# EAGLE design ZigFlea_v6 (EAGLE 5.08)
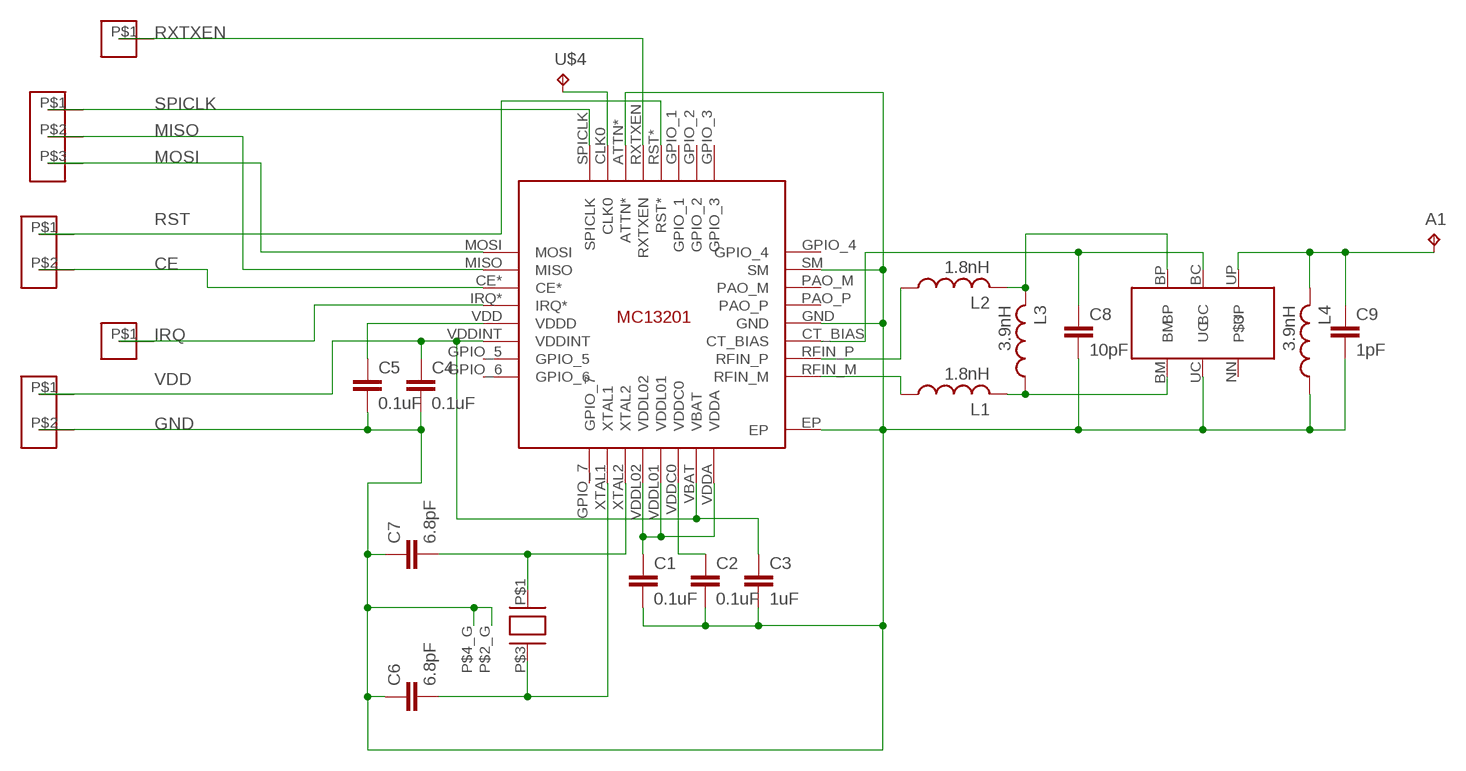
[diagram p0: schematic, sheet 1]

## Parts
A1  TPTP06SQ  [TP06SQ]
C1  0.1uF  C-EUC0603  [C0603]
C2  0.1uF  C-EUC0603  [C0603]
C3  1uF  C-EUC0603  [C0603]
C4  0.1uF  C-EUC0603  [C0603]
C5  0.1uF  C-EUC0603  [C0603]
C6  6.8pF  C-EUC0603  [C0603]
C7  6.8pF  C-EUC0603  [C0603]
C8  10pF  C-EUC0603  [C0603]
C9  1pF  C-EUC0603  [C0603]
L1  1.8nH  SPOLE0603  [SPOLE0603]
L2  1.8nH  SPOLE0603  [SPOLE0603]
L3  3.9nH  SPOLE0603  [SPOLE0603]
L4  3.9nH  SPOLE0603  [SPOLE0603]
RD8  PINHEAD1_1MM  [PINHEAD_1MM]
RE4  PINHEAD1_1MM  [PINHEAD_1MM]
U$1  MC13201  [MC13201]
U$2  16MHZ  [16MHZ]
U$3  BALUN  [BALUN]
U$4  TPTP06SQ  [TP06SQ]
U$5  PINHEAD3_1MM  [PINHEAD3_1MM]
U$6  PINHEAD2_1MM  [PINHEAD2_1MM]
U$7  PINHEAD2_1MM  [PINHEAD2_1MM]

## Nets
A1: A1.TP C9.1 L4.P$2 U$3.UP
CE: U$1.CE* U$6.P$2
GND: C1.2 C2.2 C3.2 C4.2 C5.2 C6.1 C7.1 C8.2 C9.2 L4.P$1 U$1.ATTN* U$1.EP U$1.GND U$1.SM U$2.P$2_G(P$3_G) U$2.P$4_G U$3.UC U$7.P$2
IRQ: RD8.P$1 U$1.IRQ*
MISO: U$1.MISO U$5.P$2
MOSI: U$1.MOSI U$5.P$3
N$1: C1.1 U$1.VDDA U$1.VDDL01 U$1.VDDL02
N$2: C2.1 U$1.VDDC0
N$3: U$1.CLK0 U$4.TP
N$4: C7.2 U$1.XTAL2 U$2.P$1
N$6: L1.P$1 U$1.RFIN_M
N$7: L2.P$1 U$1.RFIN_P
N$8: C5.1 U$1.VDD(VDDD)
N$9: C6.2 U$1.XTAL1 U$2.P$3
N$10: C8.1 U$1.CT_BIAS U$3.BC
N$11: L1.P$2 L3.P$1 U$3.BM
N$12: L2.P$2 L3.P$2 U$3.BP
RST: U$1.RST* U$6.P$1
RXTXEN: RE4.P$1 U$1.RXTXEN
SPICLK: U$1.SPICLK U$5.P$1
VDD: C3.1 C4.1 U$1.VBAT U$1.VDDINT U$7.P$1
Unconnected: U$1.GPIO_1 U$1.GPIO_2 U$1.GPIO_3 U$1.GPIO_4 U$1.GPIO_5 U$1.GPIO_6 U$1.GPIO_7 U$1.PAO_M U$1.PAO_P U$3.NN

## Library data of the parts
A1 U$4 = testpad:TP: Test pad
C1-C9 = resistor:C-EU: CAPACITOR, European symbol
L1-L4 = resistor:SPOLE0603
RD8 RE4 = Pinhead_my:PINHEAD1_1MM
U$1 = mc13201:MC13201
U$2 = mc13201:16MHZ
U$3 = freescale_16qfn:BALUN
U$5 = Pinhead_my:PINHEAD3_1MM
U$6 U$7 = Pinhead_my:PINHEAD2_1MM

## Board
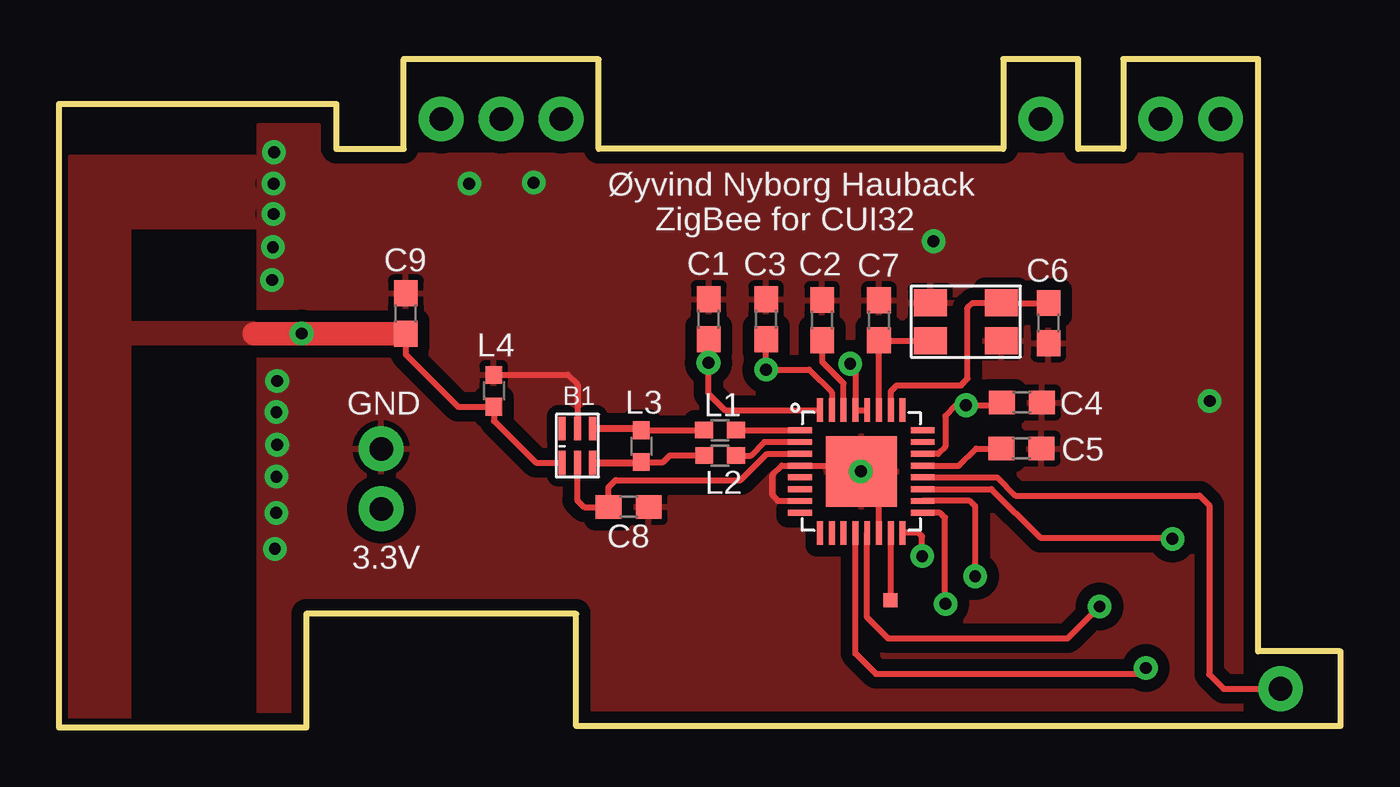
[diagram p1: board, top side]
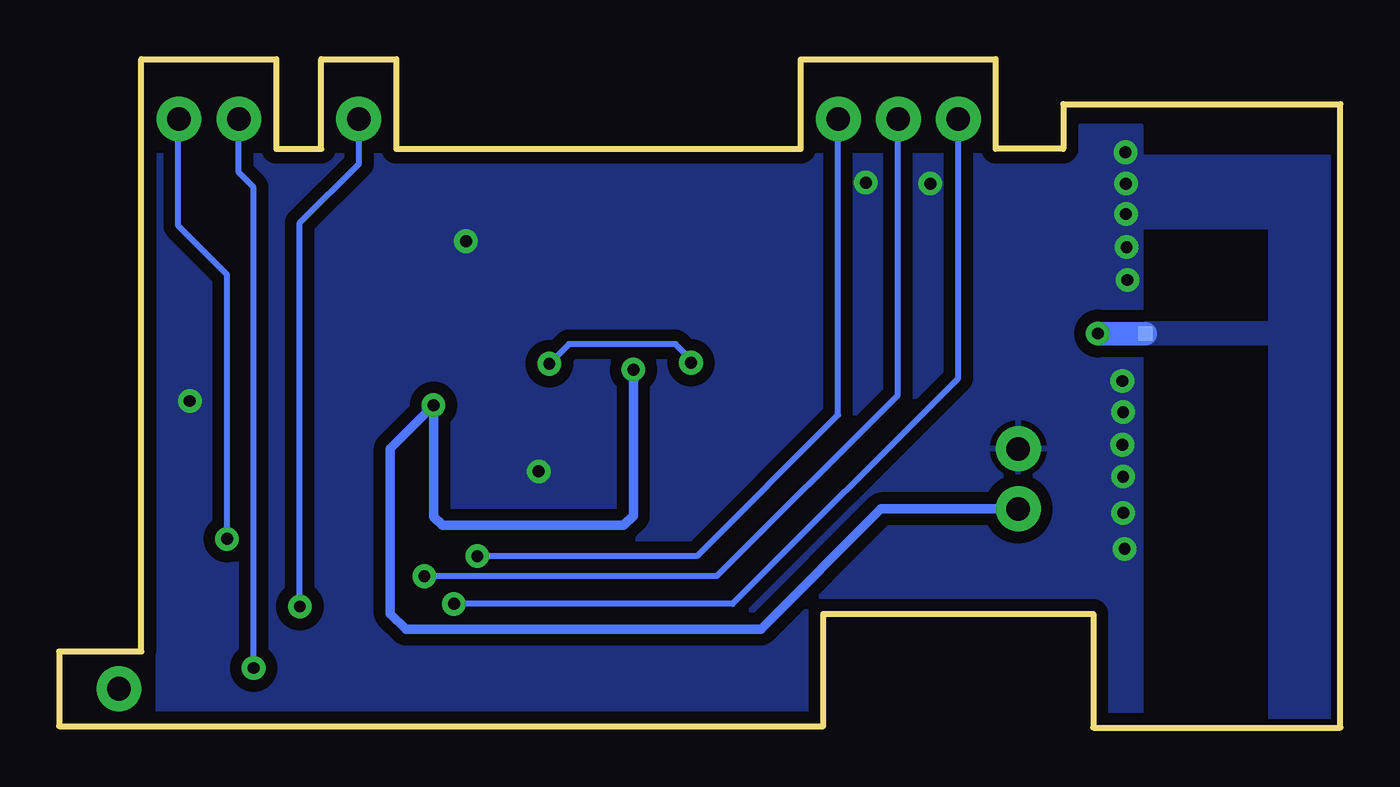
[diagram p2: board, bottom side, seen from below]

Size 54.29 x 28.32 mm. Coordinates in mm from the lower left corner, seen from the top.
Outline: 54.29,3.24 50.8,3.24 50.8,28.32 45.09,28.32 45.09,24.51 43.18,24.51 43.18,28.32 40,28.32 40,24.51 22.86,24.51 22.86,28.31 14.6,28.32 14.6,24.51 11.75,24.51 11.75,26.42 0,26.42 0,0 10.48,0 10.48,4.83 21.91,4.83 21.91,0.06 54.29,0.06 54.29,3.24
Copper layers (1*16): Top 0.035mm / dielectric 1.5mm / Bottom 0.035mm
Design rules "SeedDRC": minimum track width 6mil, minimum drill 10mil, track to track 6mil, track to pad 6mil, pad to pad 6mil, via to via 6mil, smd to smd 6mil, copper to edge 10mil, drill to drill 10mil, minimum pad ring 10mil, minimum via ring 6mil, stop-mask expansion 2mil, vias tented up to drill 100mil, thermal gap 10mil

### Footprints (pad centres in the part's own frame; a part is rotated, then mirrored left to right if it is on the bottom)
TP06SQ = smd 0.6 x 0.6: TP 0,0
C0603 = smd 1.1 x 1: 1 -0.85,0; 2 0.85,0
SPOLE0603 = smd 0.75 x 0.7: P$1 -0.675,0; P$2 0.675,0
PINHEAD_1MM = drill 1 pad 1.9 round: P$1 0,0
MC13201 = smd 0.25 x 1: ATTN* -0.75,2.6; CLK0 -1.25,2.6; GPIO_1 0.75,2.6; GPIO_2 1.25,2.6; GPIO_3 1.75,2.6; GPIO_7 -1.75,-2.6; RST* 0.25,2.6; RXTXEN -0.25,2.6; SPICLK -1.75,2.6; VBAT 1.25,-2.6; VDDA 1.75,-2.6; VDDC0 0.75,-2.6; VDDL01 0.25,-2.6; VDDL02 -0.25,-2.6; XTAL1 -1.25,-2.6; XTAL2 -0.75,-2.6 | smd 1 x 0.25: CE* -2.6,0.75; CT_BIAS 2.6,-0.75; GND 2.6,-0.25; GPIO_4 2.6,1.75; GPIO_5 -2.6,-1.25; GPIO_6 -2.6,-1.75; IRQ* -2.6,0.25; MISO -2.6,1.25; MOSI -2.6,1.75; PAO_M 2.6,0.75; PAO_P 2.6,0.25; RFIN_M 2.6,-1.75; RFIN_P 2.6,-1.25; SM 2.6,1.25; VDD -2.6,-0.25; VDDINT -2.6,-0.75 | smd 3 x 3: EP 0,0
16MHZ = smd 1.4 x 1.15: P$1 1.5,0.8; P$2_G 1.5,-0.8; P$3 -1.5,-0.8; P$4_G -1.5,0.8
BALUN = smd 0.3 x 1: BC 0.65,1.45; BM 0,0; BP 0,1.45; NN 1.3,0; UC 0.65,0; UP 1.3,1.45
PINHEAD3_1MM = drill 1 pad 1.9 round: P$1 0,2.54; P$2 0,0; P$3 0,-2.54
PINHEAD2_1MM = drill 1 pad 1.9 round: P$1 0,1.27; P$2 0,-1.27

### Placement (x,y rotation side)
A1  8.27,16.69 0 bottom
C1  27.53,17.31 90 top
C2  32.33,17.27 90 top
C3  29.96,17.3 90 top
C4  40.8,13.77 0 top
C5  40.77,11.83 0 top
C6  41.92,17.14 90 top
C7  34.74,17.26 270 top
C8  24.14,9.35 0 top
C9  14.69,17.54 90 top
L1  28,12.61 180 top
L2  28.01,11.53 180 top
L3  24.67,11.92 270 top
L4  18.42,14.27 270 top
RD8  51.75,1.65 0 top
RE4  41.59,25.78 0 top
U$1  33.99,10.85 180 top
U$2  38.42,17.2 180 top
U$3  22.61,12.67 180 top
U$4  35.23,5.4 180 top
U$5  18.73,25.78 270 top
U$6  47.94,25.78 90 top
U$7  13.65,10.54 180 top

### Tracks (layer width: path | path; a pad name or v marks a point on that pad's centre or on a via)
A1  (via drill 0.5 pad 1)
  Top 0.25: U$3.UP 20.2,11.22 18.42,13 18.42,13.58 L4.P$2 16.91,13.59 14.69,15.82 C9.1
  Top 1: A1.TP C9.1 | A1.TP | v10.28,16.7 A1.TP
  Bottom 1: A1.TP v10.27,16.69 v10.28,16.7
  pour Top (isolate 0.254, no thermals): 8.52,21.19 8.52,24.19 0.47,24.19 0.47,0.39 2.97,0.39 2.97,16.29 8.27,16.29 8.27,17.14 2.97,17.14 2.97,21.19
  pour Bottom (no thermals): 8.27,17.14 2.97,17.14 2.97,21.19 8.52,21.19 8.52,24.19 0.47,24.19 0.47,0.39 2.97,0.39 2.97,16.29 8.27,16.29
CE  (via drill 0.5 pad 1)
  Top 0.25: U$1.CE* 39.51,10.1 41.57,8.05 47.13,8.05 v47.17,8
  Bottom 0.25: v47.17,8 47.17,19.19 49.24,21.26 49.24,25.76 U$6.P$2
GND  (via drill 0.5 pad 1)
  Top 0.25: U$1.ATTN* 34.74,10.1 U$1.EP 33.74,11.1 | C1.2 | U$3.UC 21.96,14.54 21.55,14.95 18.43,14.95 L4.P$1 | 33,11.11 32.99,11.1 U$1.GND 30.63,11.1 30.23,10.71 30.23,9.84 30.46,9.61 U$1.SM
  other vias: 9.06,20.35 37.05,20.6 9.03,18.96 9.21,9.1 9.21,10.64 9.15,7.58 33.97,10.86 9.24,11.99 9.21,13.37 9.24,14.69 9.09,21.75 9.09,23.04 9.11,24.37 17.38,23.04 20.11,23.08 48.75,13.84
  pour Bottom (isolate 0.5): 8.47,25.48 8.47,0.05 50.08,0.05 50.08,24.23 10.99,24.23 10.99,25.48
  pour Top (isolate 0.5): 8.47,25.48 8.47,0.05 50.08,0.05 50.08,24.23 10.99,24.23 10.99,25.48
IRQ
  Top 0.25: U$1.IRQ* 39.75,10.6 40.53,9.83 48.32,9.83 48.73,9.42 48.73,2.26 49.34,1.65 RD8.P$1
MISO  (via drill 0.5 pad 1)
  Top 0.25: U$1.MISO 38.59,9.6 38.82,9.38 v38.82,6.42
  Bottom 0.25: v38.82,6.42 26.43,6.42 18.76,14.09 18.76,25.76 U$5.P$2
MOSI  (via drill 0.5 pad 1)
  Top 0.25: U$1.MOSI 37.33,9.1 37.54,8.9 37.54,5.27 v37.56,5.25
  Bottom 0.25: v37.56,5.25 25.76,5.25 16.2,14.81 U$5.P$3
N$1  (via drill 0.5 pad 1)
  Top 0.25: U$1.VDDL02 U$1.VDDL01 33.74,15.19 v33.52,15.42 | U$1.VDDA 28.21,13.45 27.52,14.15 v27.52,15.46 27.52,16.45 C1.1
  Bottom 0.25: v27.52,15.46 27.56,15.5 27.56,15.64 28.17,16.25 32.69,16.25 v33.52,15.42
N$2
  Top 0.25: 32.32,16.41 C2.1 32.34,15.49 33.24,14.58 U$1.VDDC0
N$3
  Top 0.25: U$1.CLK0 35.24,5.41 U$4.TP
N$4
  Top 0.25: U$1.XTAL2 C7.2 U$2.P$1
N$6
  Top 0.25: U$1.RFIN_M L1.P$1
N$7
  Top 0.25: U$1.RFIN_P 29.89,12.1 29.31,11.53 L2.P$1
N$8
  Top 0.25: U$1.VDD 38.14,11.1 38.86,11.83 C5.1 | C5.1
N$9
  Top 0.25: C6.2 39.93,17.99 U$2.P$3 38.71,18 38.49,17.78 38.49,14.78 38.21,14.5 35.5,14.5 35.24,14.25 U$1.XTAL1
N$10
  Top 0.25: U$1.CT_BIAS 29.99,11.6 28.88,10.49 23.59,10.49 23.28,10.18 C8.1 22.25,9.34 21.95,9.64 21.96,9.65 U$3.BC
N$11
  Top 0.25: L3.P$1 L1.P$2 | L3.P$1 | L3.P$1 24.64,12.61 24.57,12.67
  Top 0.3: U$3.BM 24.57,12.67
N$12
  Top 0.25: L3.P$2 24.75,11.16 | L2.P$2 25.89,11.53 25.6,11.25 L3.P$2 | L3.P$2 24.55,11.25 24.52,11.22
  Top 0.3: U$3.BP 24.52,11.22
RST  (via drill 0.5 pad 1)
  Top 0.25: U$1.RST* 33.74,3.15 34.61,2.29 45.81,2.29 v46.05,2.53
  Bottom 0.25: U$6.P$1 46.68,23.52 46.05,22.89 v46.05,2.53
RXTXEN  (via drill 0.5 pad 1)
  Top 0.25: U$1.RXTXEN 34.24,4.67 35.13,3.79 42.74,3.79 v44.09,5.14
  Bottom 0.25: v44.09,5.14 44.09,21.4 41.59,23.9 RE4.P$1
SPICLK  (via drill 0.5 pad 1)
  Top 0.25: U$1.SPICLK 36.42,8.25 36.57,8.11 v36.57,7.27
  Bottom 0.25: v36.57,7.27 27.27,7.27 21.29,13.25 21.29,25.77 U$5.P$1
VDD  (via drill 0.5 pad 1)
  Top 0.25: U$1.VDDINT 37.24,11.6 37.55,11.91 37.55,13.2 38.01,13.66 v38.43,13.66 39.83,13.66 C4.1 | v29.96,15.17 C3.1 | v29.96,15.17 | U$1.VBAT 32.74,14.2 31.78,15.17 v29.96,15.17
  Bottom 0.4: U$7.P$1 19.46,9.27 24.56,4.18 39.6,4.18 40.26,4.84 40.26,11.83 v38.43,13.66 38.43,8.95 38.05,8.57 30.37,8.57 29.96,8.98 v29.96,15.17

### Text on the board
tPlace: Øyvind Nyborg Hauback | ZigBee for CUI32 | GND | 3.3V
tNames: B1